# EAGLE design ClockClock_Main_X40 (EAGLE 9.5.1)
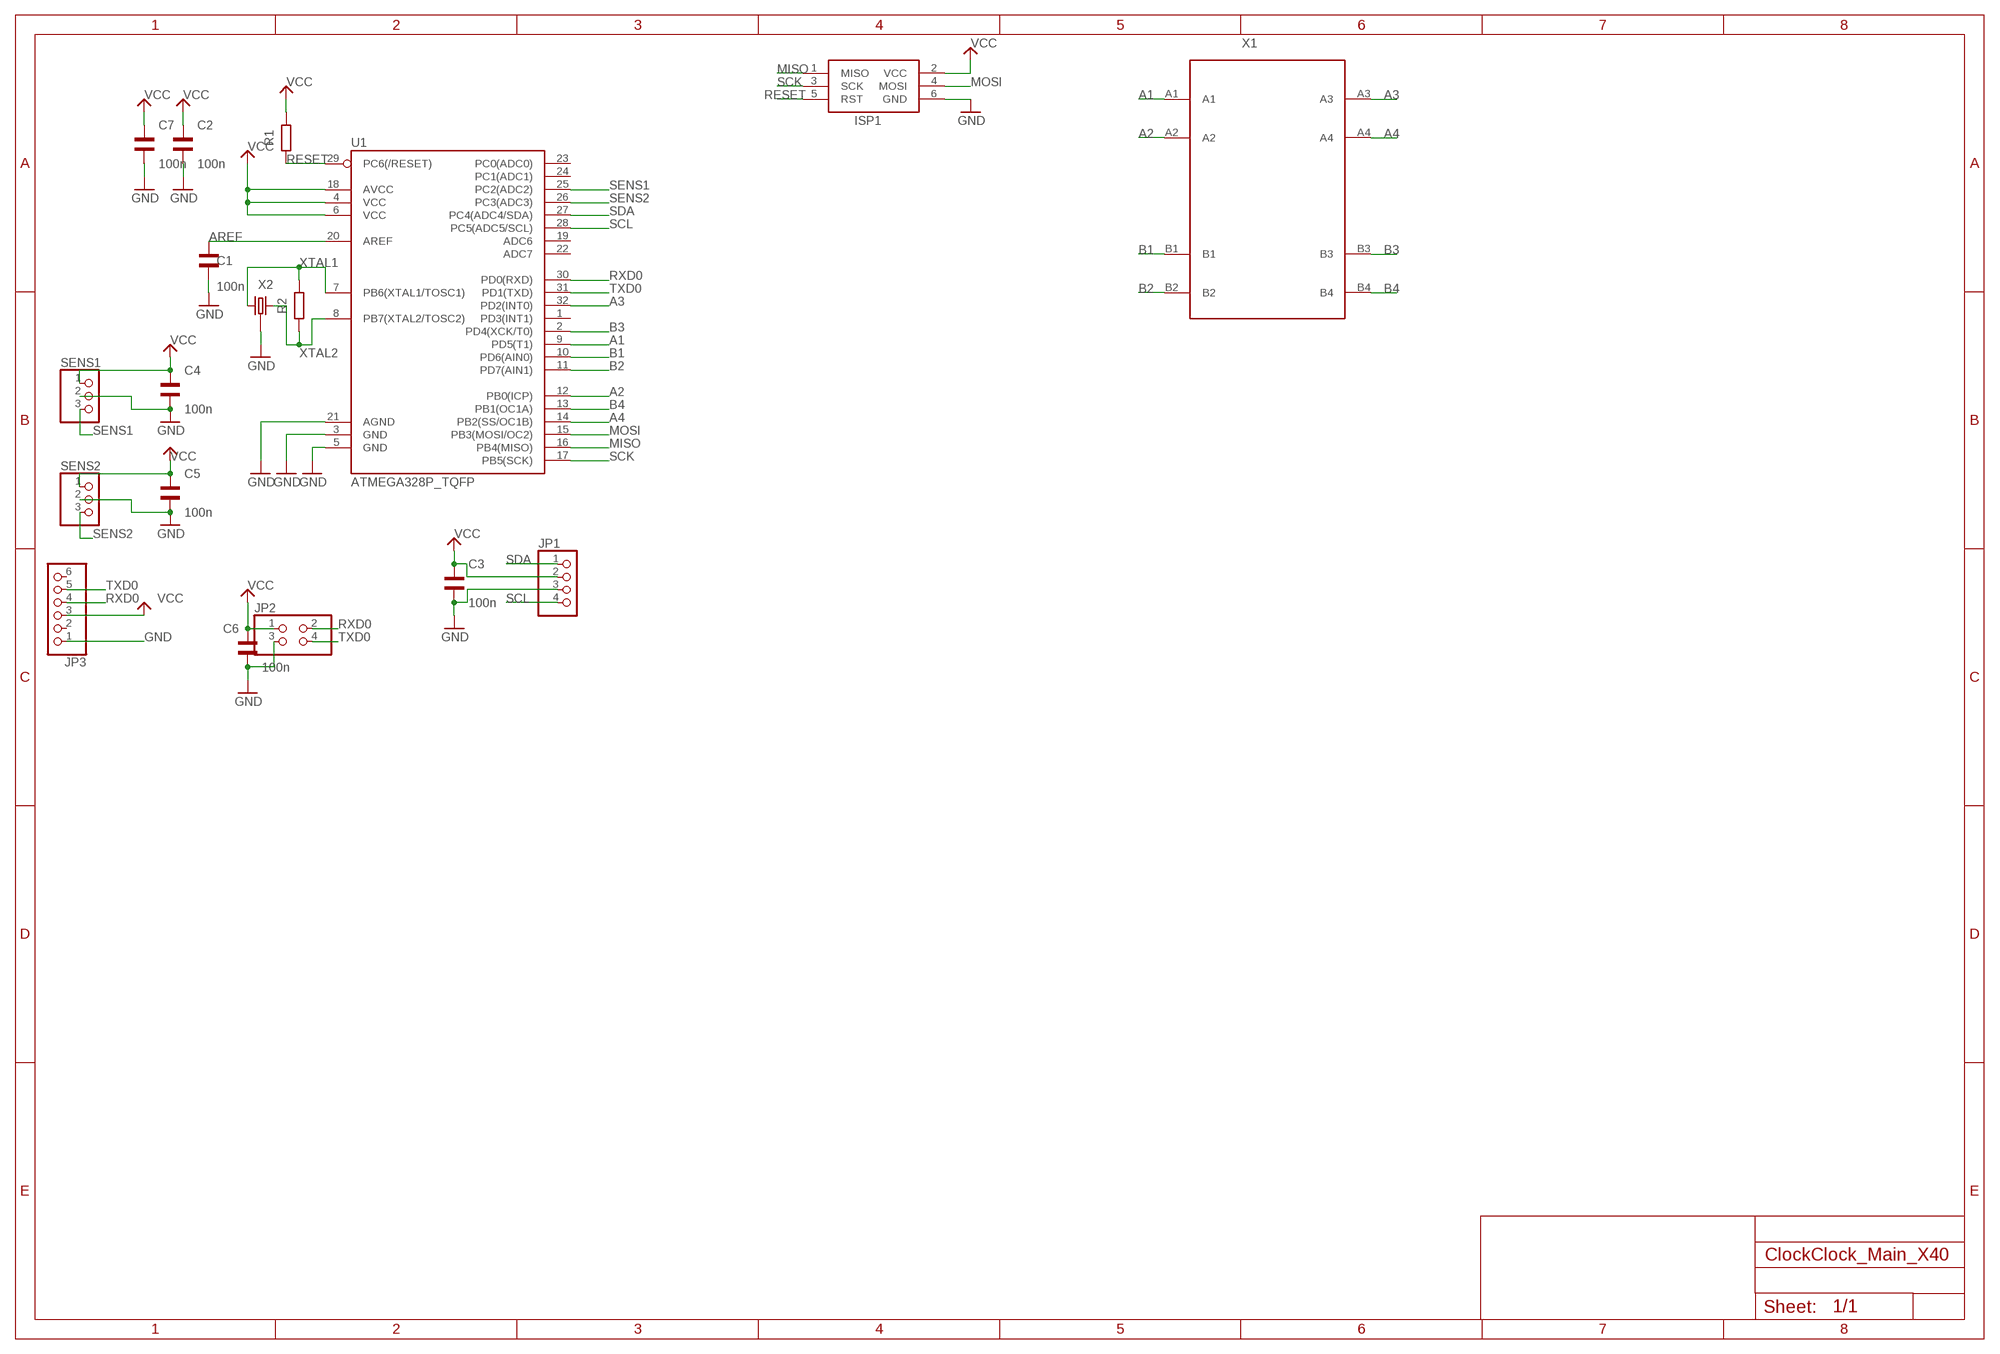
[diagram p0: schematic, sheet 1]

## Parts
C1  100n  WCAP-CSMH_1206_885342208002_WAVE  [WCAP-CSMH_1206_WAVE]
C2  100n  WCAP-CSMH_1206_885342208002_WAVE  [WCAP-CSMH_1206_WAVE]
C3  100n  WCAP-CSMH_1206_885342208002_WAVE  [WCAP-CSMH_1206_WAVE]
C4  100n  WCAP-CSMH_1206_885342208002_WAVE  [WCAP-CSMH_1206_WAVE]
C5  100n  WCAP-CSMH_1206_885342208002_WAVE  [WCAP-CSMH_1206_WAVE]
C6  100n  WCAP-CSMH_1206_885342208002_WAVE  [WCAP-CSMH_1206_WAVE]
C7  100n  WCAP-CSMH_1206_885342208002_WAVE  [WCAP-CSMH_1206_WAVE]
ISP1  AVRISP-6  [AVRISP]
JP1  PINHD-1X4/90  [1X04/90]
JP2  PINHD-2X2  [2X02]
JP3  PINHD-1X6  [1X06]
R1  15k  R-EU_R1206  [R1206]
R2  1M  R-EU_R0805  [R0805]
SENS1  PINHD-1X3  [1X03]
SENS2  PINHD-1X3  [1X03]
U1  ATMEGA328P_TQFP  [TQFP32-08]
X1  X40_MOTOR  [X40_MOTOR]
X2  AEL_ZTT_RESONATOR_16M  [AEL_ZTT_RESONATOR]

## Nets
A1: U1.9(PD5(T1)) X1.A1
A2: U1.12(PB0(ICP)) X1.A2
A3: U1.32(PD2(INT0)) X1.A3
A4: U1.14(PB2(SS/OC1B)) X1.A4
AREF: C1.2 U1.20(AREF)
B1: U1.10(PD6(AIN0)) X1.B1
B2: U1.11(PD7(AIN1)) X1.B2
B3: U1.2(PD4(XCK/T0)) X1.B3
B4: U1.13(PB1(OC1A)) X1.B4
GND: C1.1 C2.1 C3.1 C4.1 C5.1 C6.1 C7.1 ISP1.6(GND) JP1.3 JP2.3 JP3.1 SENS1.2 SENS2.2 U1.3(GND) U1.5(GND) U1.21(AGND) X2.GND
MISO: ISP1.1(MISO) U1.16(PB4(MISO))
MOSI: ISP1.4(MOSI) U1.15(PB3(MOSI/OC2))
RESET: ISP1.5(RST) R1.1 U1.29(PC6(/RESET))
RXD0: JP2.2 JP3.4 U1.30(PD0(RXD))
SCK: ISP1.3(SCK) U1.17(PB5(SCK))
SCL: JP1.4 U1.28(PC5(ADC5/SCL))
SDA: JP1.1 U1.27(PC4(ADC4/SDA))
SENS1: SENS1.3 U1.25(PC2(ADC2))
SENS2: SENS2.3 U1.26(PC3(ADC3))
TXD0: JP2.4 JP3.5 U1.31(PD1(TXD))
VCC: C2.2 C3.2 C4.2 C5.2 C6.2 C7.2 ISP1.2(VCC) JP1.2 JP2.1 JP3.3 R1.2 SENS1.1 SENS2.1 U1.4(VCC) U1.6(VCC) U1.18(AVCC) ; supply symbol labelled 5V
XTAL1: R2.2 U1.7(PB6(XTAL1/TOSC1)) X2.P$1
XTAL2: R2.1 U1.8(PB7(XTAL2/TOSC2)) X2.P$3
Unconnected: JP3.2 JP3.6 U1.1(PD3(INT1)) U1.19(ADC6) U1.22(ADC7) U1.23(PC0(ADC0)) U1.24(PC1(ADC1))

## Library data of the parts
C1-C7 = Wurth_Elektronik_Passive_Capacitors_rev19a:WCAP-CSMH_1206: WCAP-CSMH Ceramic Capacitors Characteristics MLCC - Multilayer Ceramic Chip Capacitor Recommended soldering: Reflow Wave Soldering only recommended for parts in 0603, 0805, 1206 with a thickness < 1 mm Operating temperature range: –55 °C to +125 °C Available Ceramic Types: Class 1 – NP0 / Class 2 – X7R Applications DC-DC converters Surge and Burst requirements i.e. in I/O applications and ports DC blocking/ High Voltage coupling Snubbers for high frequency converters <http://katalog.we-online.de/media/images/v2/Family_WCAP-CSMH.jpg> Details see: http://katalog.we-online.de/en/pbs/WCAP-CSMH? Created By Yingchun,Shan 2017-07-19 2017 (C) Wurth Elektronik; WE-NUMBER: 885342208002/100nF
ISP1 = adafruit:AVRISP: AVR ISP HEADER Standard 6 pin header for AVR programming
JP1 = pinhead:PINHD-1X4: PIN HEADER
JP2 = pinhead:PINHD-2X2: PIN HEADER
JP3 = pinhead:PINHD-1X6: PIN HEADER
R1 R2 = resistor:R-EU_: RESISTOR, European symbol
SENS1 SENS2 = adafruit:PINHD-1X3: PIN HEADER
U1 = SparkFun-IC-Microcontroller:ATMEGA328P_TQFP: Popular 328P in QFP Storefront component: ATmega328 - TQFP <https://www.sparkfun.com/products/13448> (COM-13448) Datasheet <http://www.sparkfun.com/datasheets/Components/SMD/ATMega328.pdf> SparkFun Products SparkFun RedBoard - Programmed with Arduino <https://www.sparkfun.com/products/12757> (DEV-12757) Arduino Pro Mini 328 - 5V/16MHz <https://www.sparkfun.com/products/11113> (DEV-11113) Arduino Pro Mini 328 - 3.3V/8MHz <https://www.sparkfun.com/products/11114> (DEV-11114) SparkFun OpenLog <https://www.sparkfun.com/products/13712> (DEV-13712) SparkFun MicroView - OLED Arduino Module <https://www.sparkfun.com/products/12923> (DEV-12923) SparkFun Digital Sandbox <https://www.sparkfun.com/products/12651> (DEV-12651) SparkFun PicoBoard <https://www.sparkfun.com/products/11888> (WIG-11888) Arduino Fio <https://www.sparkfun.com/products/10116> (DEV-10116) LilyPad Arduino 328 Main Board <https://www.sparkfun.com/products/13342> (DEV-13342) SparkFun RedStick <https://www.sparkfun.com/products/13741> (DEV-13741) LilyPad MP3 <https://www.sparkfun.com/products/11013> (DEV-11013) LilyPad Arduino SimpleSnap <https://www.sparkfun.com/products/10941> (DEV-10941) SparkFun Stepoko <https://www.sparkfun.com/products/13899> (ROB-13899) SparkFun Geiger Counter <https://www.sparkfun.com/products/11345> (SEN-11345) SparkFun EL Sequencer <https://www.sparkfun.com/products/12781> (COM-12781) Arduino Pro 328 - 5V/16MHz <https://www.sparkfun.com/products/10915> (DEV-10915) CryptoCape <https://www.sparkfun.com/products/12773> (DEV-12773) SparkFun IR Thermometer Evaluation Board - MLX90614 <https://www.sparkfun.com/products/10740> (SEN-10740) SparkFun RedBot Mainboard <https://www.sparkfun.com/products/12097> (ROB-12097) Arduino Pro 328 - 3.3V/8MHz <https://www.sparkfun.com/products/10914> (DEV-10914) SparkFun Block for Intel® Edison - Arduino <https://www.sparkfun.com/products/13036> (DEV-13036) SparkFun Simon Says - Surface Mount Soldering Kit <https://www.sparkfun.com/products/10935> (KIT-10935) SparkFun 7-Segment Serial Display - Red <https://www.sparkfun.com/products/11441> (COM-11441) SparkFun 7-Segment Serial Display - White <https://www.sparkfun.com/products/11629> (COM-11629) SparkFun 7-Segment Serial Display - Yellow <https://www.sparkfun.com/products/11443> (COM-11443) SparkFun 7-Segment Serial Display - Kelly Green <https://www.sparkfun.com/products/11440> (COM-11440) SparkFun 7-Segment Serial Display - Blue <https://www.sparkfun.com/products/11442> (COM-11442) SparkFun OpenSegment Serial Display - 20mm (Blue) <https://www.sparkfun.com/products/11647> (COM-11647) SparkFun OpenSegment Serial Display - 20mm (Green) <https://www.sparkfun.com/products/11646> (COM-11646) SparkFun OpenSegment Serial Display - 20mm (White) <https://www.sparkfun.com/products/11648> (COM-11648) SparkFun OpenSegment Serial Display - 20mm (Red) <https://www.sparkfun.com/products/11644> (COM-11644) SparkFun OpenSegment Serial Display - 20mm (Yellow) <https://www.sparkfun.com/products/11645> (COM-11645) SparkFun OpenSegment Shield <https://www.sparkfun.com/products/13190> (DEV-13190); PROD_ID: IC-09069
X1 = AAAnthony:X40_MOTOR
X2 = AAAnthony:AEL_ZTT_RESONATOR_16M

## Board
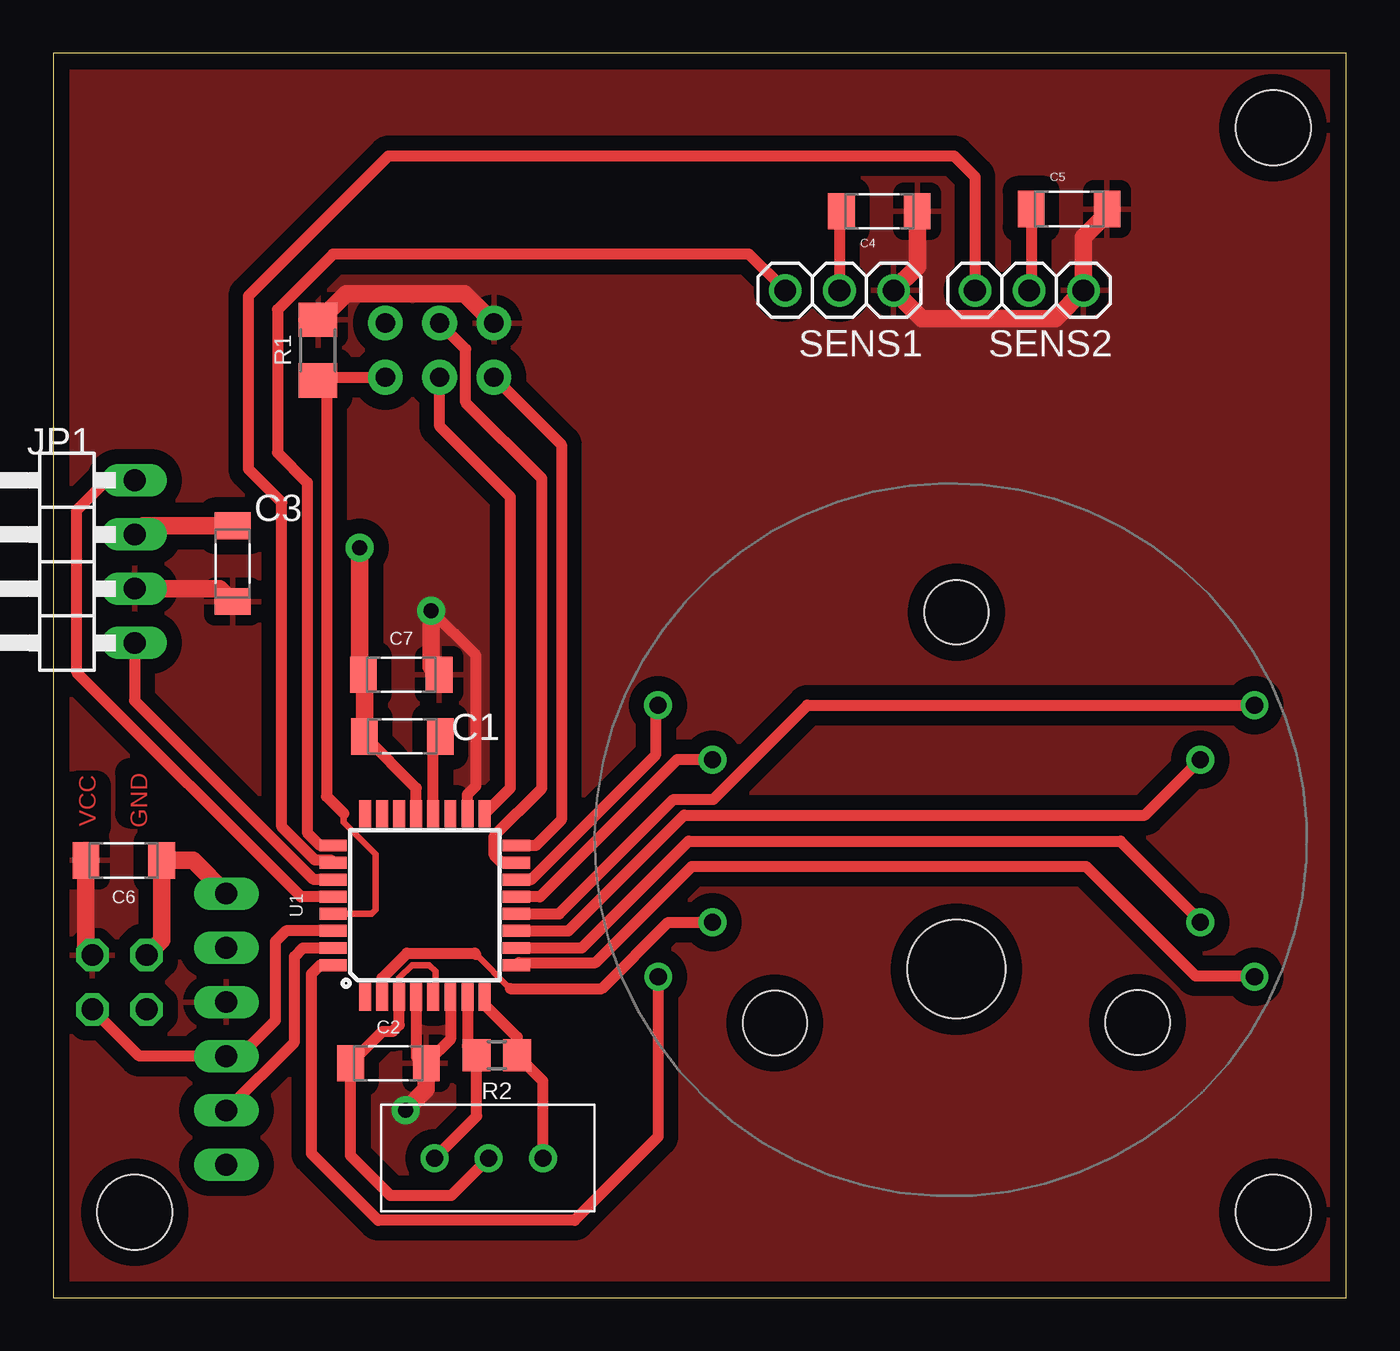
[diagram p1: board, top side]
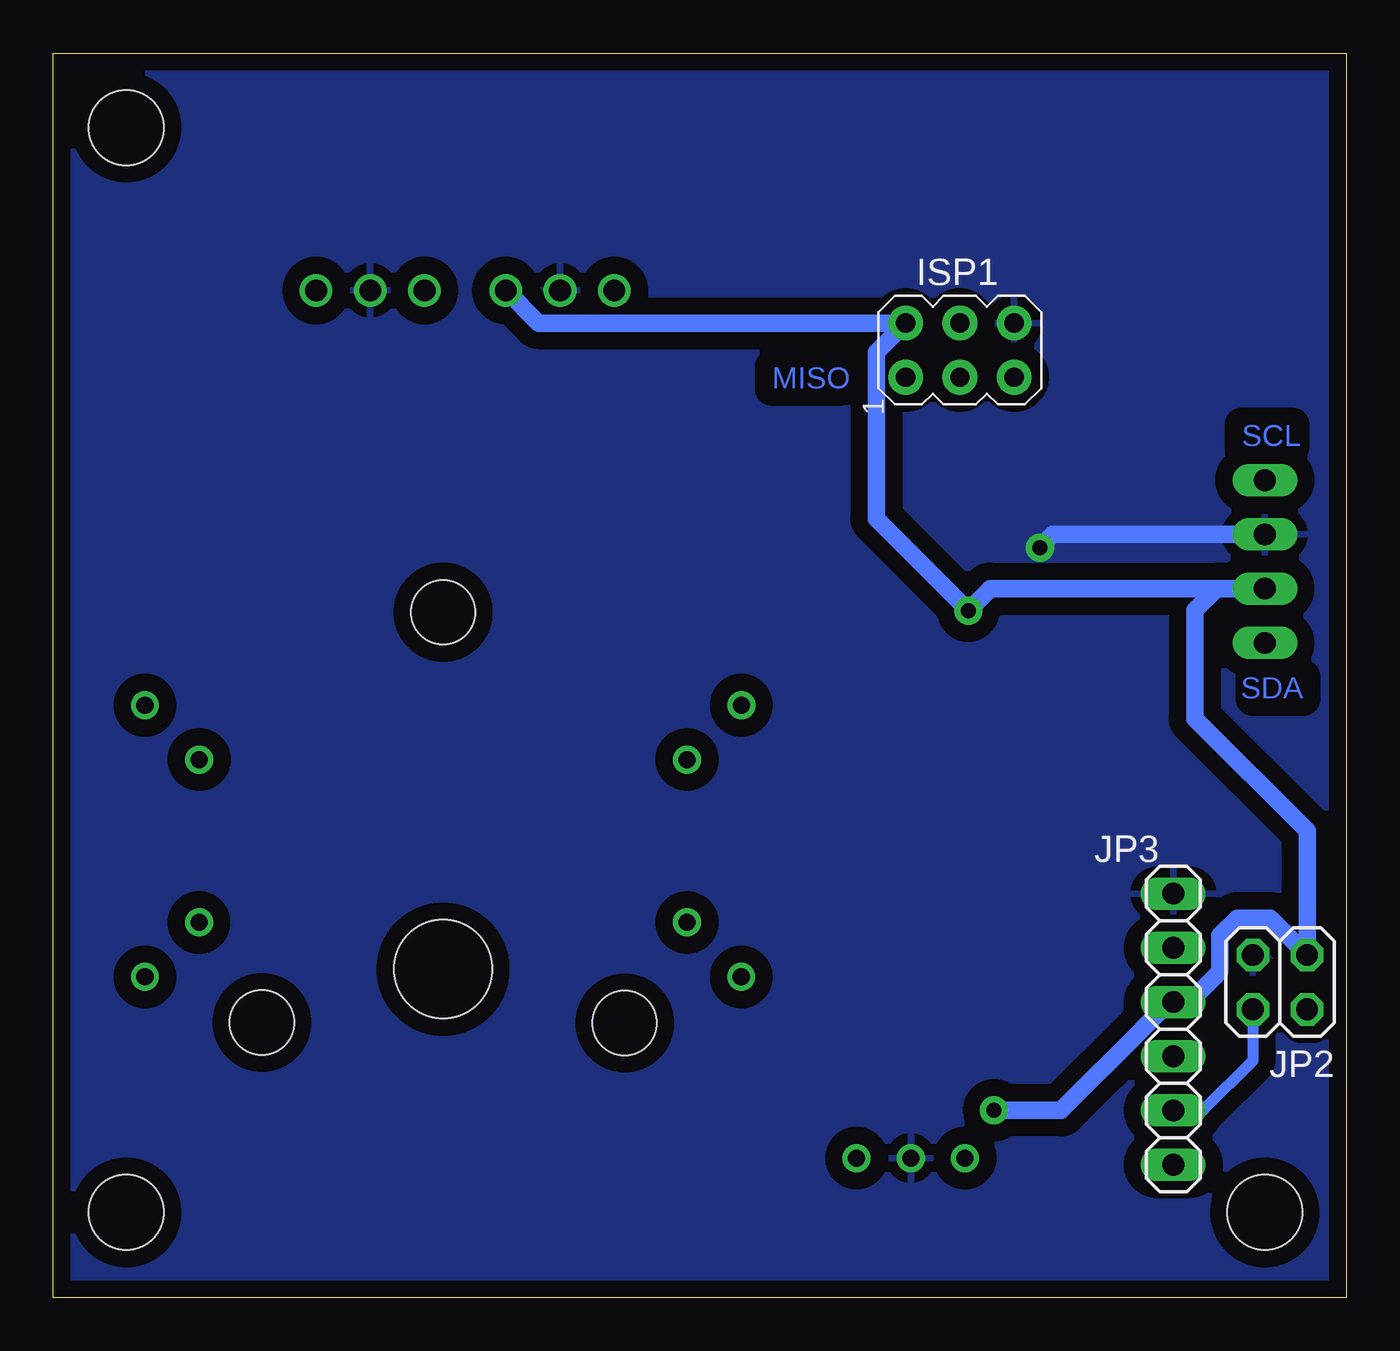
[diagram p2: board, bottom side, seen from below]

Size 60.57 x 58.27 mm. Coordinates in mm from the lower left corner, seen from the top.
Outline: 0,0 60.57,0 60.57,58.27 0,58.27 0,0
Copper layers (1*16): Top 0.035mm / dielectric 1.5mm / Bottom 0.035mm
Design rules "default *": minimum track width 6mil, minimum drill 0.35mm, track to track 6mil, track to pad 6mil, pad to pad 6mil, via to via 6mil, smd to smd 6mil, copper to edge 30mil, drill to drill 6mil, minimum pad ring 10mil, minimum via ring 8mil, stop-mask expansion 4mil, vias tented up to drill 0mil, thermal gap 20mil
Holes 3.5 mm at 57.15,3.99 3.81,3.99 57.15,54.79

### Footprints (pad centres in the part's own frame; a part is rotated, then mirrored left to right if it is on the bottom)
WCAP-CSMH_1206_WAVE = smd 1.25 x 1.7: 1 -1.775,0; 2 1.775,0
AVRISP = drill 0.9 pad 1.626: 1 -1.27,2.54; 2 1.27,2.54; 3 -1.27,0; 4 1.27,0; 5 -1.27,-2.54; 6 1.27,-2.54
1X04/90 = drill 1.016 long: 1 -3.81,-3.81; 2 -1.27,-3.81; 3 1.27,-3.81; 4 3.81,-3.81
2X02 = drill 1.016 octagon: 1 -1.27,-1.27; 2 -1.27,1.27; 3 1.27,-1.27; 4 1.27,1.27
1X06 = drill 1.016 long: 1 -6.35,0; 2 -3.81,0; 3 -1.27,0; 4 1.27,0; 5 3.81,0; 6 6.35,0
R1206 = smd 1.6 x 1.803: 1 -1.422,0; 2 1.422,0
R0805 = smd 1.3 x 1.5: 1 -0.95,0; 2 0.95,0
1X03 = drill 1.016: 1 -2.54,0; 2 0,0; 3 2.54,0
TQFP32-08 = smd 1.27 x 0.559: 1 -4.293,2.8; 2 -4.293,2; 3 -4.293,1.2; 4 -4.293,0.4; 5 -4.293,-0.4; 6 -4.293,-1.2; 7 -4.293,-2; 8 -4.293,-2.8; 17 4.293,-2.8; 18 4.293,-2; 19 4.293,-1.2; 20 4.293,-0.4; 21 4.293,0.4; 22 4.293,1.2; 23 4.293,2; 24 4.293,2.8 | smd 0.559 x 1.27: 9 -2.8,-4.293; 10 -2,-4.293; 11 -1.2,-4.293; 12 -0.4,-4.293; 13 0.4,-4.293; 14 1.2,-4.293; 15 2,-4.293; 16 2.8,-4.293; 25 2.8,4.293; 26 2,4.293; 27 1.2,4.293; 28 0.4,4.293; 29 -0.4,4.293; 30 -1.2,4.293; 31 -2,4.293; 32 -2.8,4.293
X40_MOTOR = drill 0.8: A1 -5.48,-2.14; A2 -5.48,-14.86; A3 22.46,-2.14; A4 22.464,-14.861; B1 -2.942,-4.69; B2 -2.94,-12.31; B3 19.92,-4.69; B4 19.92,-12.31 | hole 3: 0,0; 8.49,-19.215; 16.997,0.021 | hole 4.6: 8.49,-2.499
AEL_ZTT_RESONATOR = drill 0.8: GND 3.94,-1.3; P$1 1.4,-1.3; P$3 6.48,-1.3

### Placement (x,y rotation side)
C1  16.35,26.28 0 top
C2  15.7,10.97 0 top
C3  8.4,34.37 270 top
C4  38.7,50.88 0 top
C5  47.59,50.98 0 top
C6  3.3,20.47 180 top
C7  16.3,29.17 0 top
ISP1  18.1,44.37 90 bottom
JP1  0,34.47 90 top
JP2  3.1,14.77 180 bottom
JP3  8.1,12.57 270 bottom
R1  12.4,44.37 90 top
R2  20.78,11.34 180 top
SENS1  36.83,47.17 180 top
SENS2  45.72,47.17 180 top
U1  17.4,18.37 90 top
X1  50.8,12.88 180 top
X2  16.46,7.83 0 top

### Tracks (layer width: path | path; a pad name or v marks a point on that pad's centre or on a via)
A1
  Top 0.508: X1.A1 56.23,15.07 53.51,15.07 48.38,20.2 29.91,20.2 25.4,15.68 21.81,15.68 U1.9
A2
  Top 0.508: U1.12 23.7,17.97 29.06,23.33 30.92,23.33 35.33,27.74 X1.A2
A3
  Top 0.508: X1.A3 28.34,7.53 24.42,3.61 15.23,3.61 12.09,6.74 12.09,15.16 12.51,15.57 U1.32
A4
  Top 0.508: X1.A4 28.24,27.64 28.24,25.42 22.38,19.57 U1.14
AREF
  Top 0.508: U1.20 17.8,25.95 C1.2
B1
  Top 0.508: U1.10 24.77,16.37 29.77,21.37 50,21.37 53.74,17.63 X1.B1
B2
  Top 0.508: U1.11 24.13,17.17 29.55,22.59 51.14,22.59 X1.B2
B3
  Top 0.305: 19.8,16.07 21.4,14.47
  Top 0.508: 21.4,14.47 25.7,14.47 28.8,17.57 X1.B3 | U1.2 15.4,14.96 16.57,16.13 19.74,16.13 19.8,16.07
B4
  Top 0.508: U1.13 22.8,18.77 29.22,25.19 X1.B4
GND  (via drill 0.7 pad 1.3)
  Top 0.305: U1.3 16.2,14.97 16.8,15.57 17.6,15.57 17.9,15.27 17.9,14.18 U1.5
  Top 0.508: U1.21 17,23.85 C1.1 | X2.GND 18.64,4.77 15.8,4.77 13.92,6.64 C2.1 15.42,12.47 15.9,12.47 16.2,12.77 U1.3 | C4.1 36.83,50.78 SENS1.2 | SENS2.2 45.81,47.27 C5.1
  Top 0.813: C1.1 14.57,29.12 C7.1 14.35,29.34 v14.35,35.12 | JP1.3 4.21,36.14 C3.1 | JP2.3 5.07,16.74 C6.1 6.55,20.47 JP3.1
  Bottom 0.813: JP1.3 13.73,35.74 v14.35,35.12
  pour Bottom (isolate 0.813): 0,58.27 60.57,58.27 60.57,0 0,0
MISO
  Top 0.508: U1.16 22.6,21.17 23.8,22.37 23.8,39.94 ISP1.1
MOSI
  Top 0.508: U1.15 21,20.37 20.65,20.72 20.65,21.62 22.89,23.85 22.89,38.35 19.32,41.91 19.32,44.42 ISP1.4
RESET
  Top 0.305: 13.6,22.67 13.6,22.27 15.1,20.77 15.1,18.17 14.9,17.97 U1.29
  Top 0.508: ISP1.5 12.55,43.1 R1.1 12.8,42.55 12.8,23.47 13.6,22.67
RXD0
  Top 0.508: U1.30 10.9,17.17 10.4,16.67 10.4,12.97 8.73,11.3 JP3.4 4.03,11.3 JP2.2
SCK
  Top 0.508: ISP1.3 18.1,40.8 21.4,37.5 21.4,23.86 U1.17
SCL
  Top 0.508: U1.28 11.6,18.77 1.1,29.27 1.1,36.87 2.51,38.28 JP1.4
SDA
  Top 0.508: JP1.1 3.81,27.96 12.2,19.57 U1.27
SENS1
  Top 0.508: SENS1.3 32.59,48.87 13.1,48.87 10.5,46.27 10.5,39.57 11.9,38.17 11.9,21.78 12.51,21.17 U1.25
SENS2
  Top 0.508: U1.26 12.99,20.48 12.26,20.48 10.7,22.04 10.7,37.24 9.14,38.8 9.14,46.91 15.7,53.47 42.2,53.47 43.18,52.49 SENS2.3
TXD0
  Top 0.508: JP3.5 11.3,11.96 11.3,15.97 11.7,16.37 U1.31
  Bottom 0.508: JP2.4 4.37,11.1 6.71,8.76 JP3.5
VCC  (via drill 0.7 pad 1.3)
  Top 0.508: U1.4 17,11.27 17.3,10.97 C2.2 18.6,12.09 U1.6 | U1.18 19.4,23.56 19.8,23.96 19.8,30.07 v17.7,32.17
  Top 0.813: v16.5,8.77 17.47,9.74 C2.2 | C6.2 1.52,16.34 JP2.1 | C3.2 7.8,33.2 JP1.2 | C5.2 49.36,50.75 48.26,49.65 SENS2.1 46.94,45.85 40.69,45.85 SENS1.1 40.48,48.27 C4.2 | C7.2 17.7,29.55 v17.7,32.17 | R1.2 12.5,45.79 13.72,47.01 19.27,47.01 ISP1.2
  Bottom 0.813: 6.07,33.2 7.09,32.18 7.09,27.11 1.83,21.85 JP2.1 3.56,17.77 5.11,17.77 5.92,16.96 5.92,15.26 7.34,13.84 JP3.3 | 6.07,33.2 16.7,33.2 16.7,33.17 v17.7,32.17 22.01,36.48 22.01,44.27 ISP1.2 37.84,45.64 SENS1.1 | v16.5,8.77 13.36,8.77 9.51,12.62 | 9.51,12.62 9.52,12.62 8.86,13.28 8.86,13.84 JP3.3 | JP3.3 8.29,13.84 9.51,12.62 | JP1.2 6.07,33.2
  pour Top (isolate 0.7): 0,58.27 60.6,58.27 60.6,0.07 0,0.07
XTAL1
  Top 0.508: X2.P$1 19.83,8.5 R2.2 19.4,11.77 U1.7
XTAL2
  Top 0.508: U1.8 20.2,13.72 21.73,12.19 R2.1 22.94,10.13 X2.P$3

### Text on the board
Top: GND | VCC
Bottom: MISO | SCL | SDA